# EAGLE schematic gatedriverexample (EAGLE 6.3)
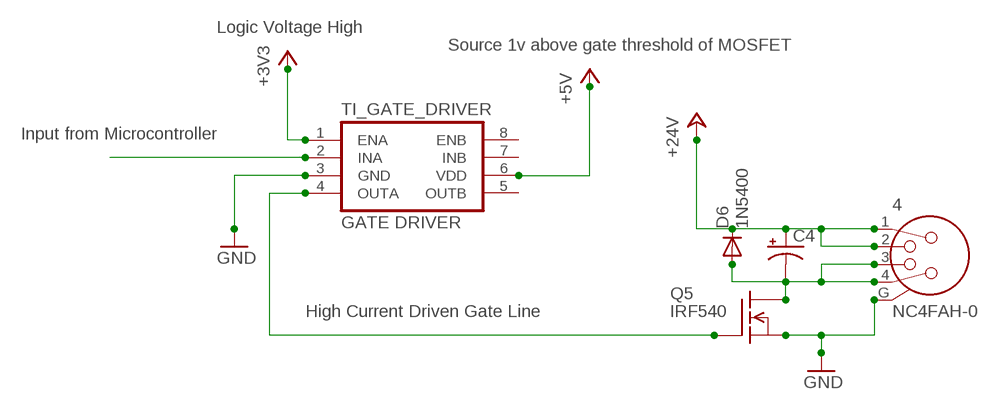
[diagram p0: schematic, sheet 1]

## Parts
4  NC4FAH-0  [NC4FAH-0]
C4  CPOL-USE2.5-6  [E2,5-6]
D6  1N5400  [DO201-15]
Q5  IRF540  [TO220]
TI_GATE_DRIVER  GATE DRIVER  IC_555-SOIC8  [SOIC-8]

## Nets
+3V3: TI_GATE_DRIVER.1(ENA)
+5V: TI_GATE_DRIVER.6(VDD)
+24V: 4.1 4.2 C4.+ D6.C
GND: 4.G Q5.3(S) TI_GATE_DRIVER.3(GND)
N$2: TI_GATE_DRIVER.2(INA)
N$15: Q5.1(G) TI_GATE_DRIVER.4(OUTA)
N$40: 4.3 4.4 C4.- D6.A Q5.2(D)
Unconnected: TI_GATE_DRIVER.5(OUTB) TI_GATE_DRIVER.7(INB) TI_GATE_DRIVER.8(ENB)

## Notes on the sheet
- Logic Voltage High
- Source 1v above gate threshold of MOSFET
- Input from Microcontroller
- High Current Driven Gate Line

## Library data of the parts
4 = con-neutrik_ag:NC4: Neutrik Audio Connector XLR SERIES Stereo 1/4" jack Source: www.neutrik.com/; MPN: NC4FAH-0; OC_FARNELL: unknown; OC_NEWARK: 45K1611
C4 = adafruit:CPOL-US: POLARIZED CAPACITOR, American symbol
D6 = diode:1N5400: DIODE standard rectifier, 3 A, 50 V (Motorola)
Q5 = transistor-fet:IRF540: N-Channel Enhancement MOSFET (HEXFET); 100V; 28A; 0,077Ohm
TI_GATE_DRIVER = dp_devices:IC_555: Classic 555 IC

## Net classes
0 Signal: width 0.508 mm